# EAGLE design uno_shield (EAGLE 7.7.0)
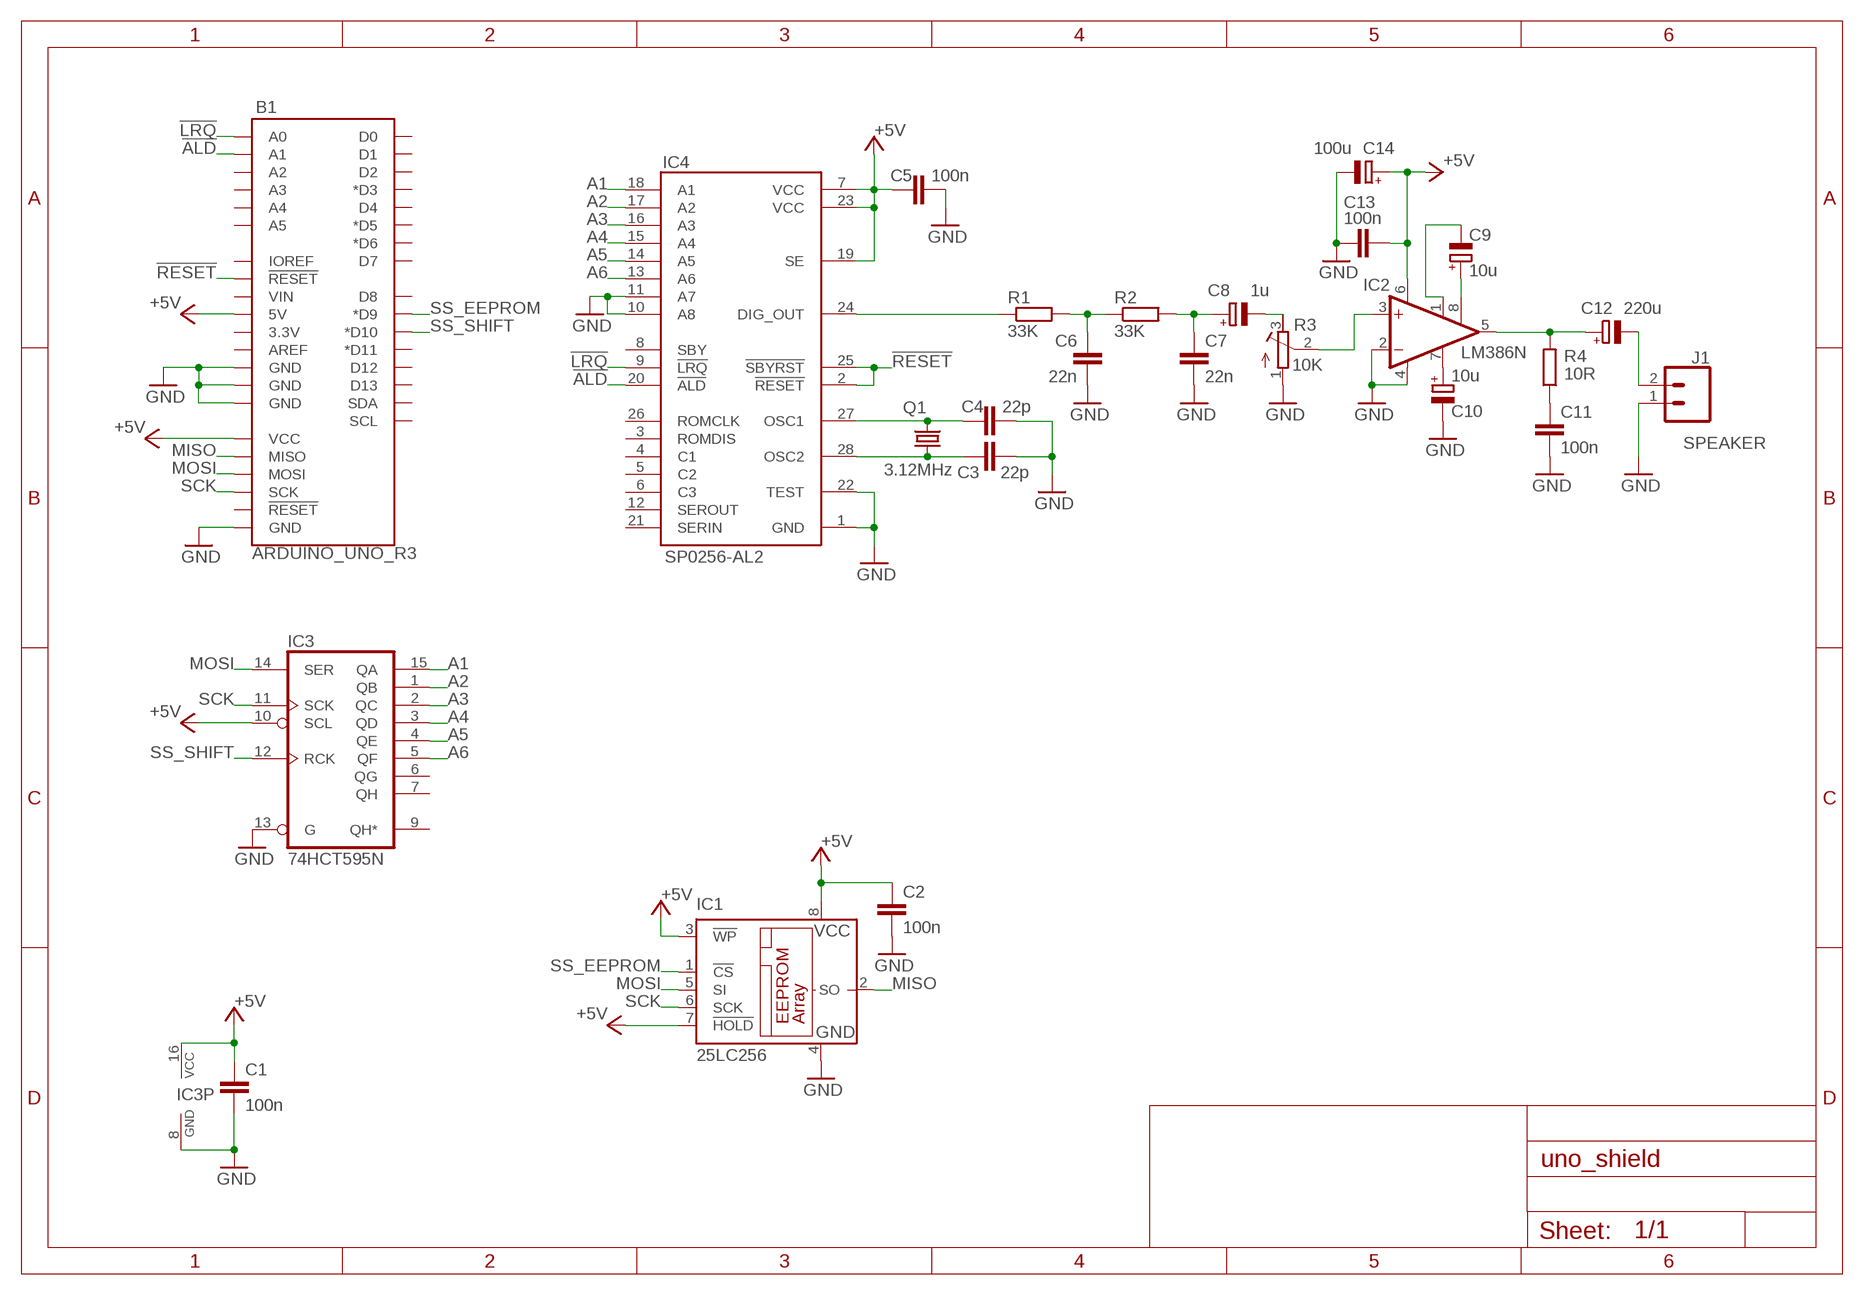
[diagram p0: schematic, sheet 1]

## Parts
B1  ARDUINO_UNO_R3  [ARDUINO_R3]
C1  100n  C-EU025-024X044  [C025-024X044]
C2  100n  C-EU025-024X044  [C025-024X044]
C3  22p  C-EU025-024X044  [C025-024X044]
C4  22p  C-EU025-024X044  [C025-024X044]
C5  100n  C-EU025-024X044  [C025-024X044]
C6  22n  C-EU025-024X044  [C025-024X044]
C7  22n  C-EU025-024X044  [C025-024X044]
C8  1u  CPOL-EUE2.5-7  [E2,5-7]
C9  10u  CPOL-EUE2.5-5  [E2,5-5]
C10  10u  CPOL-EUE2.5-5  [E2,5-5]
C11  100n  C-EU025-024X044  [C025-024X044]
C12  220u  CPOL-EUE2.5-7  [E2,5-7]
C13  100n  C-EU025-024X044  [C025-024X044]
C14  100u  CPOL-EUE2.5-7  [E2,5-7]
IC1  25LC256  25LC080P  [DIL8]
IC2  LM386N  LM386N-1  [DIL08]
IC3  74HCT595N  [DIL16]
IC4  SP0256-AL2  [DIL28-6-OCT_PADS]
J1  CONN_025MM  [SCREWTERMINAL-5MM-2]
Q1  3.12MHz  CRYSTALHC49S  [HC49/S]
R1  33K  R-EU_0309/10  [0309/10]
R2  33K  R-EU_0309/10  [0309/10]
R3  10K  R-TRIMM3296W  [RTRIM3296W]
R4  10R  R-EU_0309/10  [0309/10]

## Nets
!ALD: B1.A1 IC4.20(!ALD)
!LRQ: B1.A0 IC4.9(!LRQ)
!RESET: B1.RESET@1(!RESET!) IC4.2(!RESET) IC4.25(!SBYRST)
+5V: B1.5V B1.VCC C1.1 C2.1 C5.1 C13.2 C14.+ IC1.3(!WP) IC1.7(!HOLD) IC1.8(VCC) IC2.6(VS) IC3.10(SCL) IC3.16(VCC) IC4.7(VCC) IC4.19(SE) IC4.23(VCC)
A1: IC3.15(QA) IC4.18(A1)
A2: IC3.1(QB) IC4.17(A2)
A3: IC3.2(QC) IC4.16(A3)
A4: IC3.3(QD) IC4.15(A4)
A5: IC3.4(QE) IC4.14(A5)
A6: IC3.5(QF) IC4.13(A6)
GND: B1.GND@1(GND) B1.GND@2(GND) B1.GND@3(GND) B1.GND@4(GND) C1.2 C2.2 C3.2 C4.2 C5.2 C6.2 C7.2 C10.- C11.2 C13.1 C14.- IC1.4(GND) IC2.2(-IN) IC2.4(GND) IC3.8(GND) IC3.13(G) IC4.1(GND) IC4.10(A8) IC4.11(A7) IC4.22(TEST) J1.1 R3.1(A)
MISO: B1.MISO IC1.2(SO)
MOSI: B1.MOSI IC1.5(SI) IC3.14(SER)
N$1: IC4.24(DIG_OUT) R1.1
N$2: C3.1 IC4.28(OSC2) Q1.1
N$3: C4.1 IC4.27(OSC1) Q1.2
N$4: C6.1 R1.2 R2.1
N$5: C7.1 C8.+ R2.2
N$6: C8.- R3.3(E)
N$7: C9.- IC2.1(GAIN)
N$8: C9.+ IC2.8(GAIN)
N$9: C10.+ IC2.7(BYPASS)
N$10: C11.1 R4.1
N$11: C12.+ IC2.5(OUT) R4.2
N$12: C12.- J1.2
N$13: IC2.3(+IN) R3.2(S)
SCK: B1.SCK IC1.6(SCK) IC3.11(SCK)
SS_EEPROM: B1.D9(*D9) IC1.1(!CS)
SS_SHIFT: B1.D10(*D10) IC3.12(RCK)
Unconnected: B1.3.3V B1.A2 B1.A3 B1.A4 B1.A5 B1.AREF B1.D0 B1.D1 B1.D2 B1.D3(*D3) B1.D4 B1.D5(*D5) B1.D6(*D6) B1.D7 B1.D8 B1.D11(*D11) B1.D12 B1.D13 B1.IOREF B1.RESET@2(!RESET!) B1.SCL B1.SDA B1.VIN IC3.6(QG) IC3.7(QH) IC3.9(QH*) IC4.3(ROMDIS) IC4.4(C1) IC4.5(C2) IC4.6(C3) IC4.8(SBY) IC4.12(SEROUT) IC4.21(SERIN) IC4.26(ROMCLK)

## Notes on the sheet
- SPEAKER

## Library data of the parts
B1 = _MyPartsLibrary:ARDUINO_UNO_R3: Arduino R3 Footprint with SPI header Arduino Uno R3 Compatible Footprint. Matches PCB size of the original board. SparkFun Products: SAMD21 Dev Breakout <https://www.sparkfun.com/products/13672> RedBoard <https://www.sparkfun.com/products/12757> R3 Stackable Headers <https://www.sparkfun.com/products/11417>
C1-C7 C11 C13 = rcl:C-EU: CAPACITOR, European symbol
C8-C10 C12 C14 = rcl:CPOL-EU: POLARIZED CAPACITOR, European symbol
IC1 = _MyPartsLibrary:25*: Serial EEPROM 4K/ 8K , SPI bus; MF: MICROCHIP; MPN: 25LC080/P; OC_FARNELL: 1556143; OC_NEWARK: 92C7440
IC2 = linear:LM386?-*: Low Voltage Audio Power Amplifier Source: http://cache.national.com/ds/LM/LM386.pdf
IC3 = _MyPartsLibrary:74*595: 8-bit SHIFT REGISTER, output latch
IC4 = _MyPartsLibrary:SP0256-AL2: General Instrument SP0256-AL2 Speech Synthesizer IC
J1 = SparkFun-Connectors:CONN_02: Multi connection point. Often used as Generic Header-pin footprint for 0.1 inch spaced/style header connections On any of the 0.1 inch spaced packages, you can populate with these: Break Away Headers - Straight <https://www.sparkfun.com/products/116> (PRT-00116) Break Away Male Headers - Right Angle <https://www.sparkfun.com/products/553> (PRT-00553) Female Headers <https://www.sparkfun.com/products/115> (PRT-00115) Break Away Headers - Machine Pin <https://www.sparkfun.com/products/117> (PRT-00117) Break Away Female Headers - Swiss Machine Pin <https://www.sparkfun.com/products/743> (PRT-00743) For SCREWTERMINALS and SPRING TERMINALS visit here: Screw Terimnals on SparkFun.com <https://www.sparkfun.com/search/results?term=Screw+Terminals> (5mm/3.5mm/2.54mm spacing) This device is also useful as a general connection point to wire up your design to another part of your project. Our various solder wires solder well into these plated through hole pads. Hook-Up Wire - Assortment (Stranded, 22 AWG) <https://www.sparkfun.com/products/11375> (PRT-11375) Hook-Up Wire - Assortment (Solid Core, 22 AWG) <https://www.sparkfun.com/products/11367> (PRT-11367) View the entire wire category on our website here <https://www.sparkfun.com/categories/141> Special notes: Molex polarized connector foot print use with: PRT-08233 with associated crimp pins and housings. 2.54_SCREWTERM for use with PRT-10571. 3.5mm Screw Terminal footprints for PRT-08084 5mm Screw Terminal footprints for use with PRT-08432; SF_SKU: PRT-08432
Q1 = crystal:CRYSTAL: CRYSTAL; OC_FARNELL: 1667008; OC_NEWARK: unknown
R1 R2 R4 = rcl:R-EU_: RESISTOR, European symbol
R3 = rcl:R-TRIMM: Trimm resistor

## Board
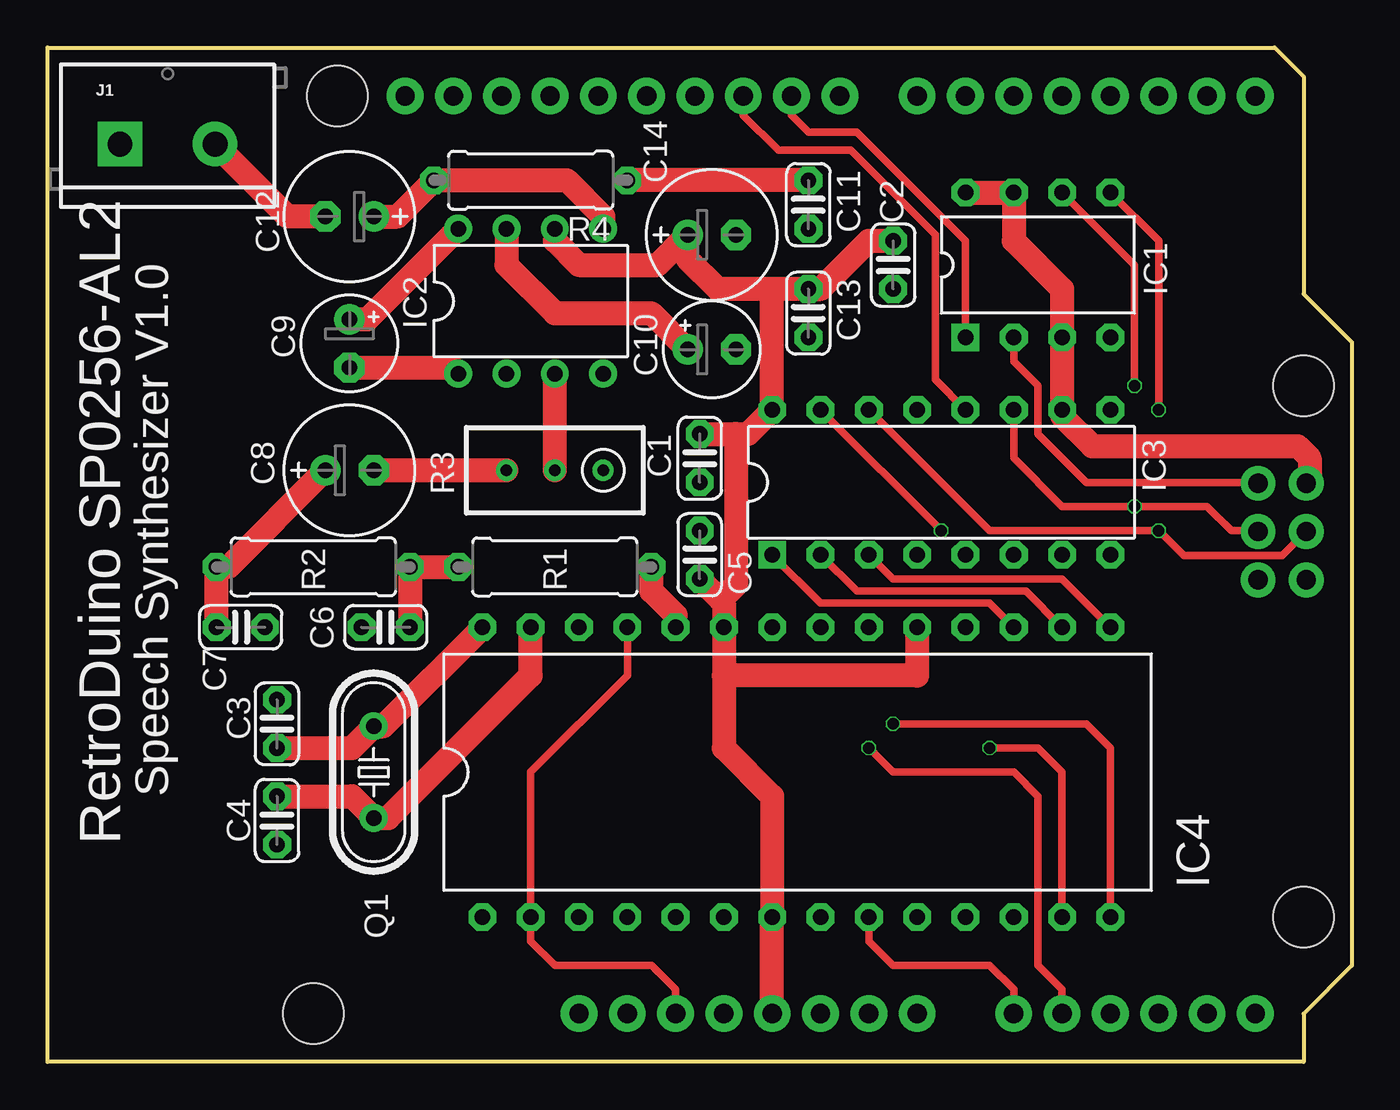
[diagram p1: board, top side]
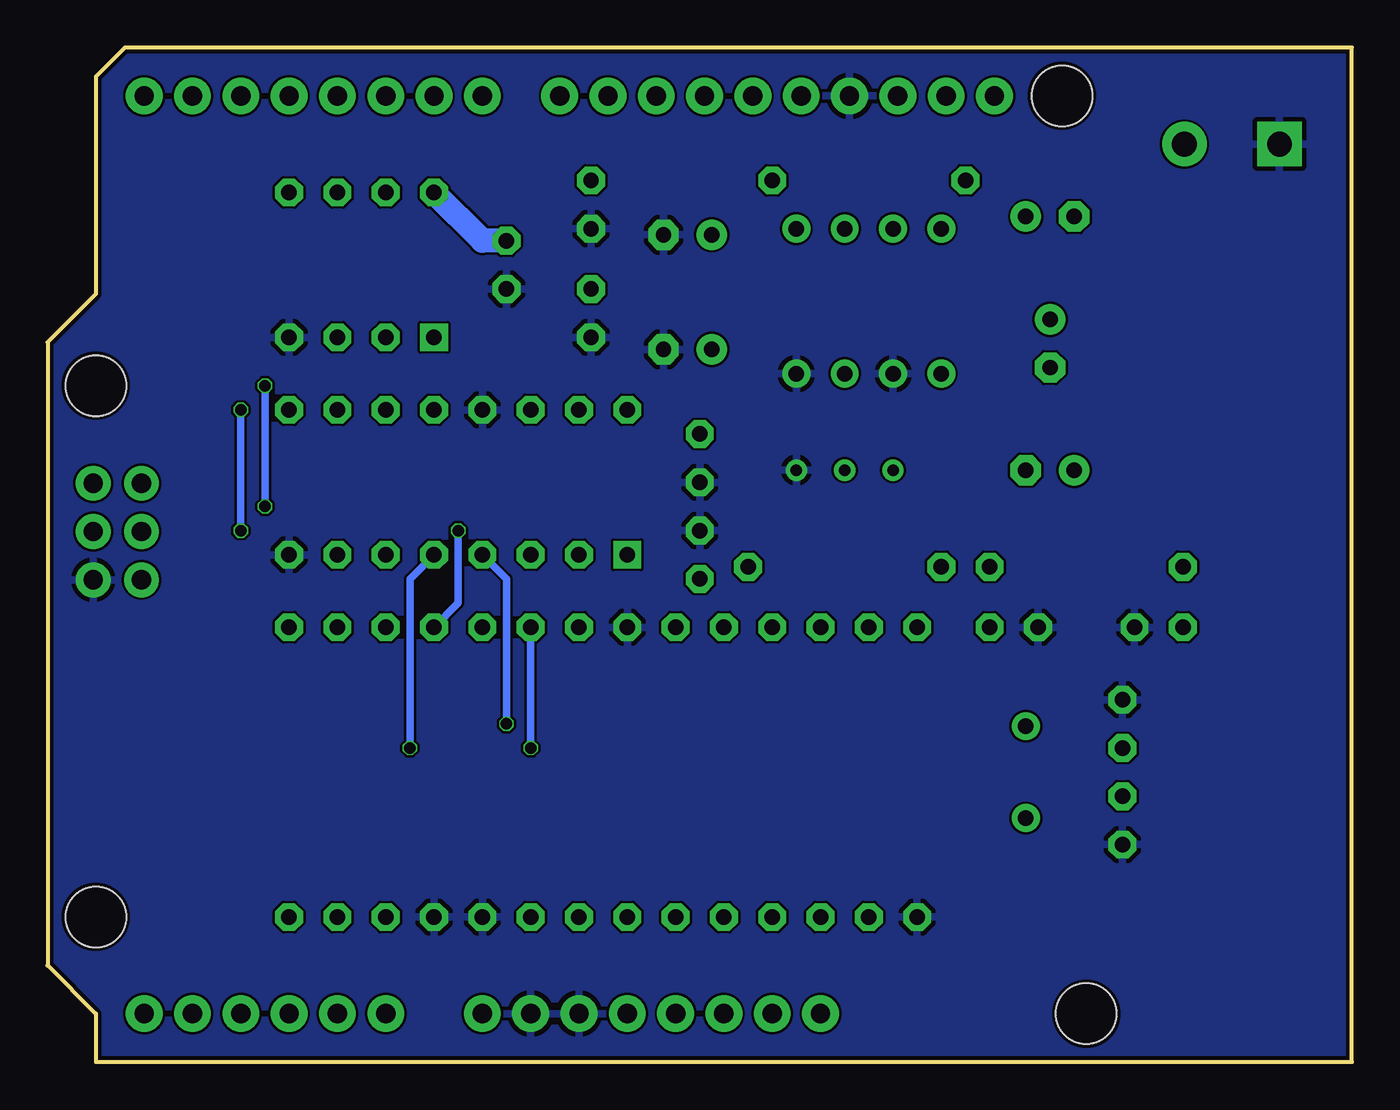
[diagram p2: board, bottom side, seen from below]

Size 68.58 x 53.34 mm. Coordinates in mm from the lower left corner, seen from the top.
Copper layers (1*16): Top 0.035mm / dielectric 1.6mm / Bottom 0.035mm
Design rules "jlcpcb-2layers": minimum track width 5mil, minimum drill 0.3mm, track to track 5mil, track to pad 5mil, pad to pad 5mil, via to via 5mil, smd to smd 5mil, copper to edge 0.2mm, drill to drill 6mil, minimum pad ring 10mil, minimum via ring 3mil, stop-mask expansion 4mil, vias tented up to drill 0mil, thermal gap 10mil

### Footprints (pad centres in the part's own frame; a part is rotated, then mirrored left to right if it is on the bottom)
ARDUINO_R3 = drill 1.016 pad 1.93: 3.3V 2.54,-24.13; 5V 5.08,-24.13; A0 17.78,-24.13; A1 20.32,-24.13; A2 22.86,-24.13; A3 25.4,-24.13; A4 27.94,-24.13; A5 30.48,-24.13; AREF -9.144,24.13; D0 30.48,24.13; D1 27.94,24.13; D2 25.4,24.13; D3 22.86,24.13; D4 20.32,24.13; D5 17.78,24.13; D6 15.24,24.13; D7 12.7,24.13; D8 8.636,24.13; D9 6.096,24.13; D10 3.556,24.13; D11 1.016,24.13; D12 -1.524,24.13; D13 -4.064,24.13; GND@1 7.62,-24.13; GND@2 10.16,-24.13; GND@3 -6.604,24.13; IOREF -2.54,-24.13; NC -5.08,-24.13; RESET@1 0,-24.13; SCL -14.224,24.13; SDA -11.684,24.13; VIN 12.7,-24.13 | drill 1.016 pad 1.778: GND@4 33.16,-1.32; MISO 30.62,3.76; MOSI 33.16,1.22; RESET@2 30.62,-1.32; SCK 30.62,1.22; VCC 33.16,3.76 | hole 3.175: -17.78,24.13; 33.02,8.89; 33.02,-19.05; -19.05,-24.13
C025-024X044 = drill 0.813 octagon: 1 -1.27,0; 2 1.27,0
E2,5-7 = drill 0.813 pad 1.6: + -1.27,0 | drill 0.813 pad 1.6 octagon: - 1.27,0
E2,5-5 = drill 0.813 pad 1.6: + -1.27,0 | drill 0.813 pad 1.6 octagon: - 1.27,0
DIL8 = drill 0.813 square: 1 -3.81,-3.81 | drill 0.813 octagon: 2 -1.27,-3.81; 3 1.27,-3.81; 4 3.81,-3.81; 5 3.81,3.81; 6 1.27,3.81; 7 -1.27,3.81; 8 -3.81,3.81
DIL08 = drill 0.813 pad 1.27: 1 -3.81,-3.81; 2 -1.27,-3.81; 3 1.27,-3.81; 4 3.81,-3.81; 5 3.81,3.81; 6 1.27,3.81; 7 -1.27,3.81; 8 -3.81,3.81
DIL16 = drill 0.813 square: 1 -8.89,-3.81 | drill 0.813 octagon: 2 -6.35,-3.81; 3 -3.81,-3.81; 4 -1.27,-3.81; 5 1.27,-3.81; 6 3.81,-3.81; 7 6.35,-3.81; 8 8.89,-3.81; 9 8.89,3.81; 10 6.35,3.81; 11 3.81,3.81; 12 1.27,3.81; 13 -1.27,3.81; 14 -3.81,3.81; 15 -6.35,3.81; 16 -8.89,3.81
DIL28-6-OCT_PADS = drill 0.813 octagon: 1 -16.51,-7.62; 2 -13.97,-7.62; 3 -11.43,-7.62; 4 -8.89,-7.62; 5 -6.35,-7.62; 6 -3.81,-7.62; 7 -1.27,-7.62; 8 1.27,-7.62; 9 3.81,-7.62; 10 6.35,-7.62; 11 8.89,-7.62; 12 11.43,-7.62; 13 13.97,-7.62; 14 16.51,-7.62; 15 16.51,7.62; 16 13.97,7.62; 17 11.43,7.62; 18 8.89,7.62; 19 6.35,7.62; 20 3.81,7.62; 21 1.27,7.62; 22 -1.27,7.62; 23 -3.81,7.62; 24 -6.35,7.62; 25 -8.89,7.62; 26 -11.43,7.62; 27 -13.97,7.62; 28 -16.51,7.62
SCREWTERMINAL-5MM-2 = drill 1.3 pad 2.032 square: 1 0,0 | drill 1.3 pad 2.032: 2 5,0
HC49/S = drill 0.813: 1 -2.413,0; 2 2.413,0
0309/10 = drill 0.813 octagon: 1 -5.08,0; 2 5.08,0
RTRIM3296W = drill 0.61: 1 0,-2.54; 2 0,0; 3 0,2.54

### Placement (x,y rotation side)
B1  33.02,26.67 0 top
C1  34.29,31.75 270 top
C2  44.45,41.91 270 top
C3  12.06,17.78 90 top
C4  12.06,12.7 270 top
C5  34.29,26.67 90 top
C6  17.78,22.86 180 top
C7  10.16,22.86 0 top
C8  15.88,31.11 0 top
C9  15.88,37.78 270 top
C10  34.92,37.47 0 top
C11  40.01,45.09 270 top
C12  15.88,44.45 180 top
C13  40.01,39.37 90 top
C14  34.92,43.5 0 top
IC1  52.07,41.91 0 top
IC2  25.4,40.01 0 top
IC3  46.99,30.48 0 top
IC4  39.37,15.24 0 top
J1  3.81,48.26 0 top
Q1  17.14,15.24 270 top
R1  26.67,26.04 180 top
R2  13.97,26.04 180 top
R3  26.67,31.11 90 top
R4  25.4,46.35 180 top

### Tracks (layer width: path | path; a pad name or v marks a point on that pad's centre or on a via)
!ALD  (via drill 0.6)
  Top 0.406: v43.18,16.51 44.45,15.24 50.8,15.24 52.07,13.97 52.07,5.08 53.34,3.81 B1.A1
  Bottom 0.406: IC4.20 v43.18,16.51
!LRQ
  Top 0.406: IC4.9 43.18,6.35 44.45,5.08 49.53,5.08 50.8,3.81 B1.A0
!RESET
  Top 0.406: IC4.25 30.48,20.32 25.4,15.24 IC4.2 25.4,6.35 26.67,5.08 31.75,5.08 33.02,3.81 B1.RESET@1
+5V
  Top 1.27: 38.1,40.64 C13.2 40.64,40.64 43.18,43.18 C2.1 | 38.1,40.64 35.24,40.64 33.66,42.23 C14.+ 32.07,41.91 27.94,41.91 26.67,43.18 IC2.6 | 36.2,33.02 36.83,33.02 IC3.16 38.1,40.64 | C5.1 35.4,24.29 | 35.4,24.29 35.56,24.13 IC4.23 35.56,20.32 | B1.5V IC4.7 38.1,13.97 35.56,16.51 35.56,20.32 | IC1.8 IC1.7 50.8,43.18 53.34,40.64 IC1.3 IC3.10 53.34,33.97 54.93,32.38 65.72,32.38 66.36,31.75 66.36,30.61 B1.VCC | IC4.19 45.72,20.32 35.56,20.32 | C1.1 36.2,33.02 | 36.2,33.02 36.2,25.08 35.4,24.29
  Bottom 1.27: C2.1 45.72,43.18 IC1.8
A1  (via drill 0.6)
  Top 0.406: IC3.15 v46.99,27.94
  Bottom 0.406: v46.99,27.94 46.99,24.13 IC4.18
A2
  Top 0.406: IC4.17 49.53,24.13 40.64,24.13 IC3.1
A3
  Top 0.406: IC3.2 42.55,24.77 51.44,24.77 IC4.16
A4
  Top 0.406: IC3.3 44.45,25.4 53.34,25.4 IC4.15
A5  (via drill 0.6)
  Top 0.406: v44.45,17.78 54.61,17.78 55.88,16.51 IC4.14
  Bottom 0.406: IC3.4 44.45,25.4 v44.45,17.78
A6  (via drill 0.6)
  Top 0.406: v49.53,16.51 52.07,16.51 53.34,15.24 IC4.13
  Bottom 0.406: IC3.5 49.53,25.4 v49.53,16.51
GND
  pour Bottom: 0,0 0,53.34 64.45,53.34 66.04,51.75 66.04,40.32 68.58,37.78 68.58,5.08 66.04,2.54 66.04,0
MISO
  Top 0.406: IC1.2 50.8,36.83 52.07,35.56 52.07,33.02 54.61,30.48 63.59,30.48
  Top 0.61: 63.59,30.48 B1.MISO
MOSI  (via drill 0.6)
  Top 0.406: IC3.14 49.53,27.94 57.15,27.94 v58.42,27.94 59.74,26.62 64.91,26.62 B1.MOSI | IC1.5 58.42,43.18 v58.42,34.29
  Bottom 0.406: v58.42,34.29 v58.42,27.94
N$1
  Top 1.27: IC4.24 33.02,23.5 31.75,24.77 R1.1
N$2
  Top 1.27: C3.1 16,16.51 Q1.1 17.65,17.65 IC4.28
N$3
  Top 1.27: C4.1 16,13.97 Q1.2 17.91,12.83 25.4,20.32 IC4.27
N$4
  Top 1.27: C6.1 R2.1 R1.2
N$5
  Top 1.27: C7.1 R2.2 9.53,26.04 C8.+
N$6
  Top 1.27: C8.- R3.3
N$7
  Top 1.27: C9.- 21.27,36.51 IC2.1
N$8
  Top 1.27: C9.+ 16.83,39.05 IC2.8
N$9
  Top 1.27: IC2.7 24.13,41.91 26.67,39.37 31.75,39.37 C10.+
N$10
  Top 1.27: C11.1 R4.1
N$11
  Top 1.27: C12.+ 18.41,44.45 R4.2 27.3,46.35 29.21,44.45 IC2.5
N$12
  Top 1.27: C12.- 12.62,44.45 J1.2
N$13
  Top 1.27: R3.2 IC2.3
SCK  (via drill 0.6)
  Top 0.406: IC3.11 50.8,31.75 53.34,29.21 55.88,29.21 v57.15,29.21 60.96,29.21 62.23,27.94 63.59,27.94 | IC1.6 57.15,41.91 v57.15,35.56
  Top 0.61: 63.59,27.94 B1.SCK
  Bottom 0.406: v57.15,35.56 v57.15,29.21
SS_EEPROM
  Top 0.406: B1.D9 39.12,49.78 40.01,48.9 42.55,48.9 48.26,43.18 IC1.1
SS_SHIFT
  Top 0.406: B1.D10 36.58,49.78 38.42,47.94 42.23,47.94 46.67,43.5 46.67,35.88 IC3.12

### Text on the board
tNames: Speech Synthesizer V1.0 | RetroDuino SP0256-AL2